# EAGLE design Ambulance Signal (EAGLE 7.6.0)
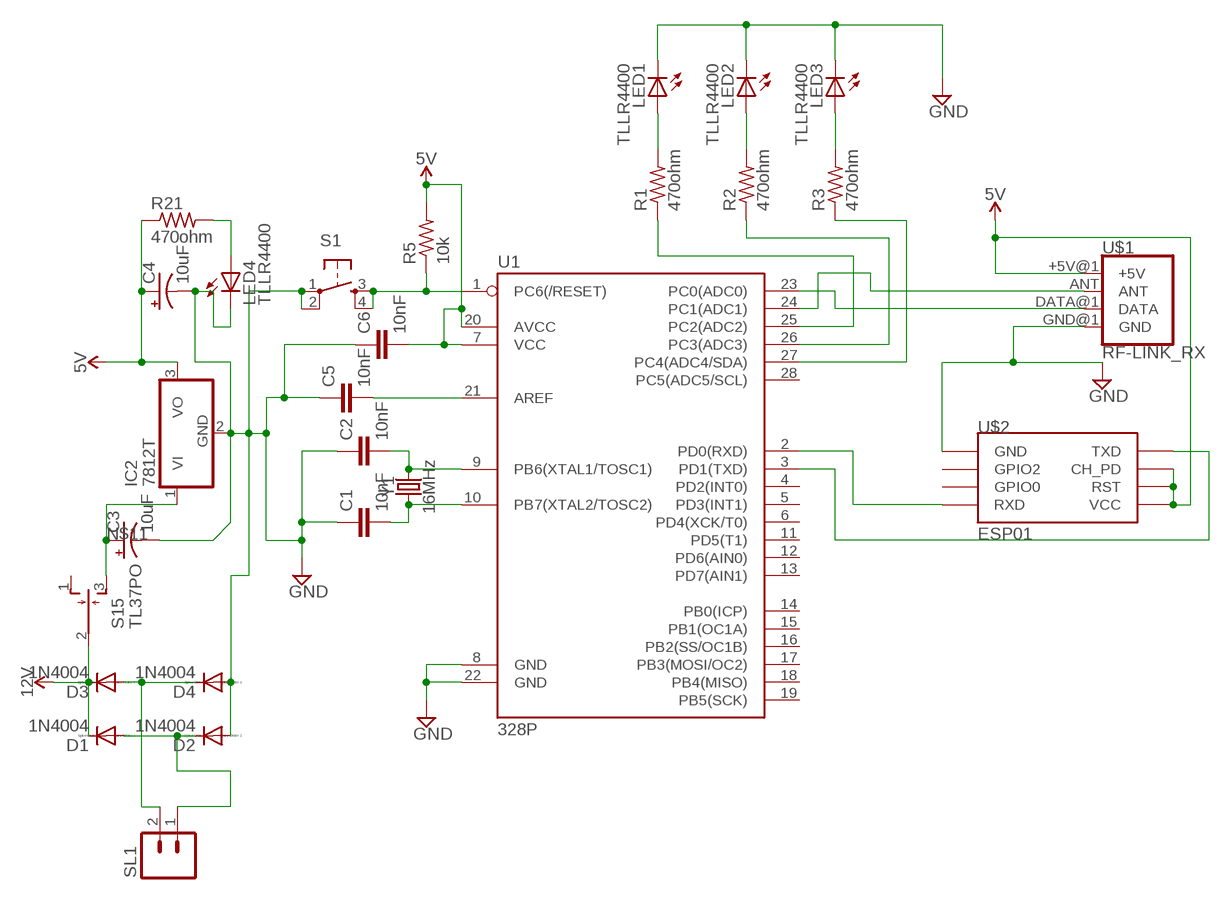
[diagram p0: schematic, sheet 1]

## Parts
C1  10nF  10NF-PTH-10MM-10000V-1-%  [CAP-PTH-10MM]
C2  10nF  10NF-PTH-10MM-10000V-1-%  [CAP-PTH-10MM]
C3  10uF  10UF-POLAR-RADIAL-2.5MM-KIT-25V-20%  [CPOL-RADIAL-2.5MM-5MM-KIT]
C4  10uF  10UF-POLAR-RADIAL-2.5MM-KIT-25V-20%  [CPOL-RADIAL-2.5MM-5MM-KIT]
C5  10nF  10NF-PTH-10MM-10000V-1-%  [CAP-PTH-10MM]
C6  10nF  10NF-PTH-10MM-10000V-1-%  [CAP-PTH-10MM]
D1  1N4004  [DO41-10]
D2  1N4004  [DO41-10]
D3  1N4004  [DO41-10]
D4  1N4004  [DO41-10]
IC2  7812T  [TO220H]
LED1  TLLR4400  [LED3MM]
LED2  TLLR4400  [LED3MM]
LED3  TLLR4400  [LED3MM]
LED4  TLLR4400  [LED3MM]
R1  470ohm  R-US_0207/12  [0207/12]
R2  470ohm  R-US_0207/12  [0207/12]
R3  470ohm  R-US_0207/12  [0207/12]
R5  10k  R-US_0207/12  [0207/12]
R21  470ohm  R-US_0207/12  [0207/12]
S1  TAC_SWITCHPTH  [TACTILE-PTH]
S15  TL37PO  [TL3XPO]
SL1  MA02  [02PA]
U1  328P  ATMEGA328P_PDIP  [DIP28]
U$1  RF-LINK_RX  [RF-LINK_RX]
U$2  ESP01  [ESP01]
Y1  16MHz  CRYSTAL-16MHZPTH-HC49US  [HC49US]

## Nets
5V: C4.1(+) C6.2 IC2.3(VO) R5.2 R21.1 U1.7(VCC) U1.20(AVCC) U$1.+5V@1(+5V) U$2.CH_PD U$2.RST U$2.VCC
12V: D1.C D3.C S15.2(P)
GND: C1.1 C2.1 C3.2(-) C4.2(-) C5.1 C6.1 D2.A D4.A IC2.2(GND) LED1.K(C) LED2.K(C) LED3.K(C) LED4.K(C) S1.1 S1.2 U1.8(GND) U1.22(GND) U$1.GND@1(GND) U$2.GND
N$1: U1.24(PC1(ADC1)) U$1.ANT
N$2: U1.23(PC0(ADC0)) U$1.DATA@1(DATA)
N$3: C2.2 U1.9(PB6(XTAL1/TOSC1)) Y1.2
N$4: C1.2 U1.10(PB7(XTAL2/TOSC2)) Y1.1
N$5: LED4.A R21.2
N$6: C5.2 U1.21(AREF)
N$9: R5.1 S1.3 S1.4 U1.1(PC6(/RESET))
N$10: D3.A D4.C SL1.2
N$11: C3.1(+) IC2.1(VI) S15.3(S)
N$12: U1.2(PD0(RXD)) U$2.RX(RXD)
N$13: U1.3(PD1(TXD)) U$2.TX(TXD)
N$14: R1.1 U1.25(PC2(ADC2))
N$15: R2.1 U1.26(PC3(ADC3))
N$16: R3.1 U1.27(PC4(ADC4/SDA))
N$17: LED1.A R1.2
N$18: LED2.A R2.2
N$19: LED3.A R3.2
N$50: D1.A D2.C SL1.1
Unconnected: S15.1(O) U1.4(PD2(INT0)) U1.5(PD3(INT1)) U1.6(PD4(XCK/T0)) U1.11(PD5(T1)) U1.12(PD6(AIN0)) U1.13(PD7(AIN1)) U1.14(PB0(ICP)) U1.15(PB1(OC1A)) U1.16(PB2(SS/OC1B)) U1.17(PB3(MOSI/OC2)) U1.18(PB4(MISO)) U1.19(PB5(SCK)) U1.28(PC5(ADC5/SCL)) U$2.GPIO0 U$2.GPIO2

## Library data of the parts
C1 C2 C5 C6 = SparkFun-Capacitors:10NF: 0.01uF/10nF/10,000pF ceramic capacitors A capacitor is a passive two-terminal electrical component used to store electrical energy temporarily in an electric field. CAP-09321; PROD_ID: CAP-09321
C3 C4 = SparkFun-Capacitors:10UF-POLAR: 10.0µF polarized capacitors A capacitor is a passive two-terminal electrical component used to store electrical energy temporarily in an electric field.; PROD_ID: CAP-08440
D1-D4 = diode:1N4004: DIODE general purpose rectifier, 1 A
IC2 = linear:78*: Positive VOLTAGE REGULATOR Source: http://cache.national.com/ds/LM/LM78L05.pdf http://www.fairchildsemi.com/ds/LM/LM7805.pdf
LED1-LED4 = led:TLLR4400: Low Current (2mA) LED 3 mm Tinted Diffused Package color RED Source: Data sheet <http://www.farnell.com/datasheets/391100.pdf>; MF: VISHAY SEMICONDUCTOR; OC_FARNELL: 1612437
R1-R3 R5 R21 = rcl:R-US_: RESISTOR, American symbol
S1 = SparkFun-Retired:TAC_SWITCH: Momentary Switch Button commonly used for reset or general input. Spark Fun Electronics SKU : COM-00097 SMT- SWCH-08247
S15 = switch:TL37PO: TINY SWITCH MOM OFF MOM Source: http://www2.produktinfo.conrad.com/datenblaetter/700000-724999/705152-da-01-de-Subminiaturschalter_TL_36YO.pdf
SL1 = con-amp-quick:MA02: AMP QUICK CONNECTOR; OC_FARNELL: unknown; OC_NEWARK: unknown
U1 = SparkFun-IC-Microcontroller:ATMEGA328P_PDIP: Atmel 328P Through hole ATMEGA328P uC used in the Arduino 32kb flash, 1k EEPROM, 2k SRAM Datasheet <http://www.sparkfun.com/datasheets/Components/SMD/ATMega328.pdf> SparkFun Products Storefront component: AVR 28 Pin 20MHz 32K 6A/D - ATMega328P <https://www.sparkfun.com/products/9061> (COM-09061) SparkFun Simon Says - Through-Hole Soldering Kit <https://www.sparkfun.com/products/10547> (KIT-10547) SparkFun Learn to Solder - Simon Says <https://www.sparkfun.com/products/13708> (KIT-13708) SparkFun BigTime Watch Kit <https://www.sparkfun.com/products/11734> (KIT-11734) SparkFun ClockIt <https://www.sparkfun.com/products/10930> (KIT-10930) SparkFun Serial Enabled LCD Kit <https://www.sparkfun.com/products/10097> (LCD-10097) SparkFun Simon Tilts - Through Hole Soldering Kit <https://www.sparkfun.com/products/12634> (KIT-12634) SparkFun Frequency Counter Kit <https://www.sparkfun.com/products/10140> (KIT-10140) FabFM Radio Kit <https://www.sparkfun.com/products/11043> (KIT-11043) SparkFun Binary Blaster Kit <https://www.sparkfun.com/products/12037> (KIT-12037) SparkFun Metro-Gnome <https://www.sparkfun.com/products/9236> (KIT-09236) ATmega328 with Arduino Optiboot (Uno) <https://www.sparkfun.com/products/10524> (DEV-10524); PROD_ID: IC-09136
U$1 = SparkFun-RF:RF-LINK_RX: RF Link Receiver (434 MHz, 315 MHz) These wireless receivers work with equivalent transmitters. They can easily fit into a breadboard and work well with microcontrollers to create a very simple wireless data link. Since these are only receivers, they will only work communicating data one-way, you would need two pairs (of different frequencies) to act as a transmitter/receiver pair.. SparkFun Products RF Link Receiver - 4800bps (434 MHz) <https://www.sparkfun.com/products/10532>(WRL-10532); SF_ID: WRL-10533
U$2 = esp8266modules:ESP01: ESP8266 Wifi module 01
Y1 = SparkFun-Clocks:CRYSTAL-16MHZ: 16MHz Crystal Digikey Example <http://www.digikey.com/product-search/en?keywords=535-9122-1-ND> Frequency: 16MHz Frequency Stability: ±50ppm Frequency Tolerance: ±20ppm Load Capacitance: 18pF SparkFun Products: Pro Micro -5V/16MHz <https://www.sparkfun.com/products/12640> SparkFun Serial Enabled LCD Kit <https://www.sparkfun.com/products/10097>; PROD_ID: XTAL-08181; SF_ID: COM-00536

## Board
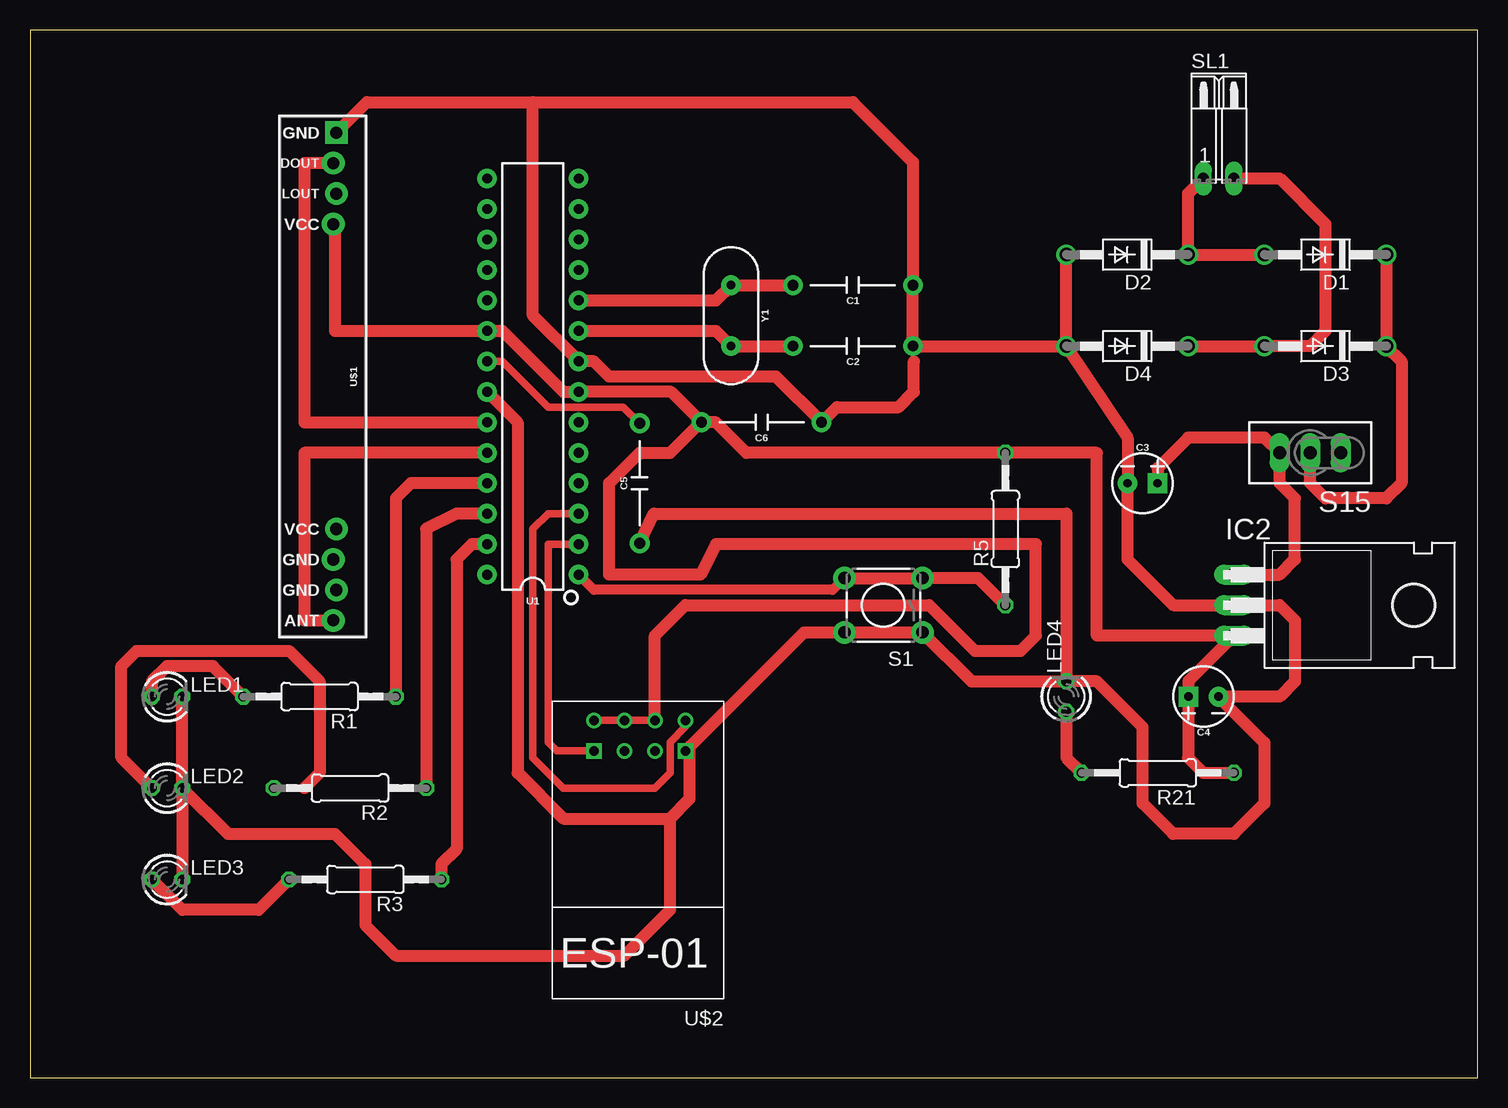
[diagram p1: board, top side]
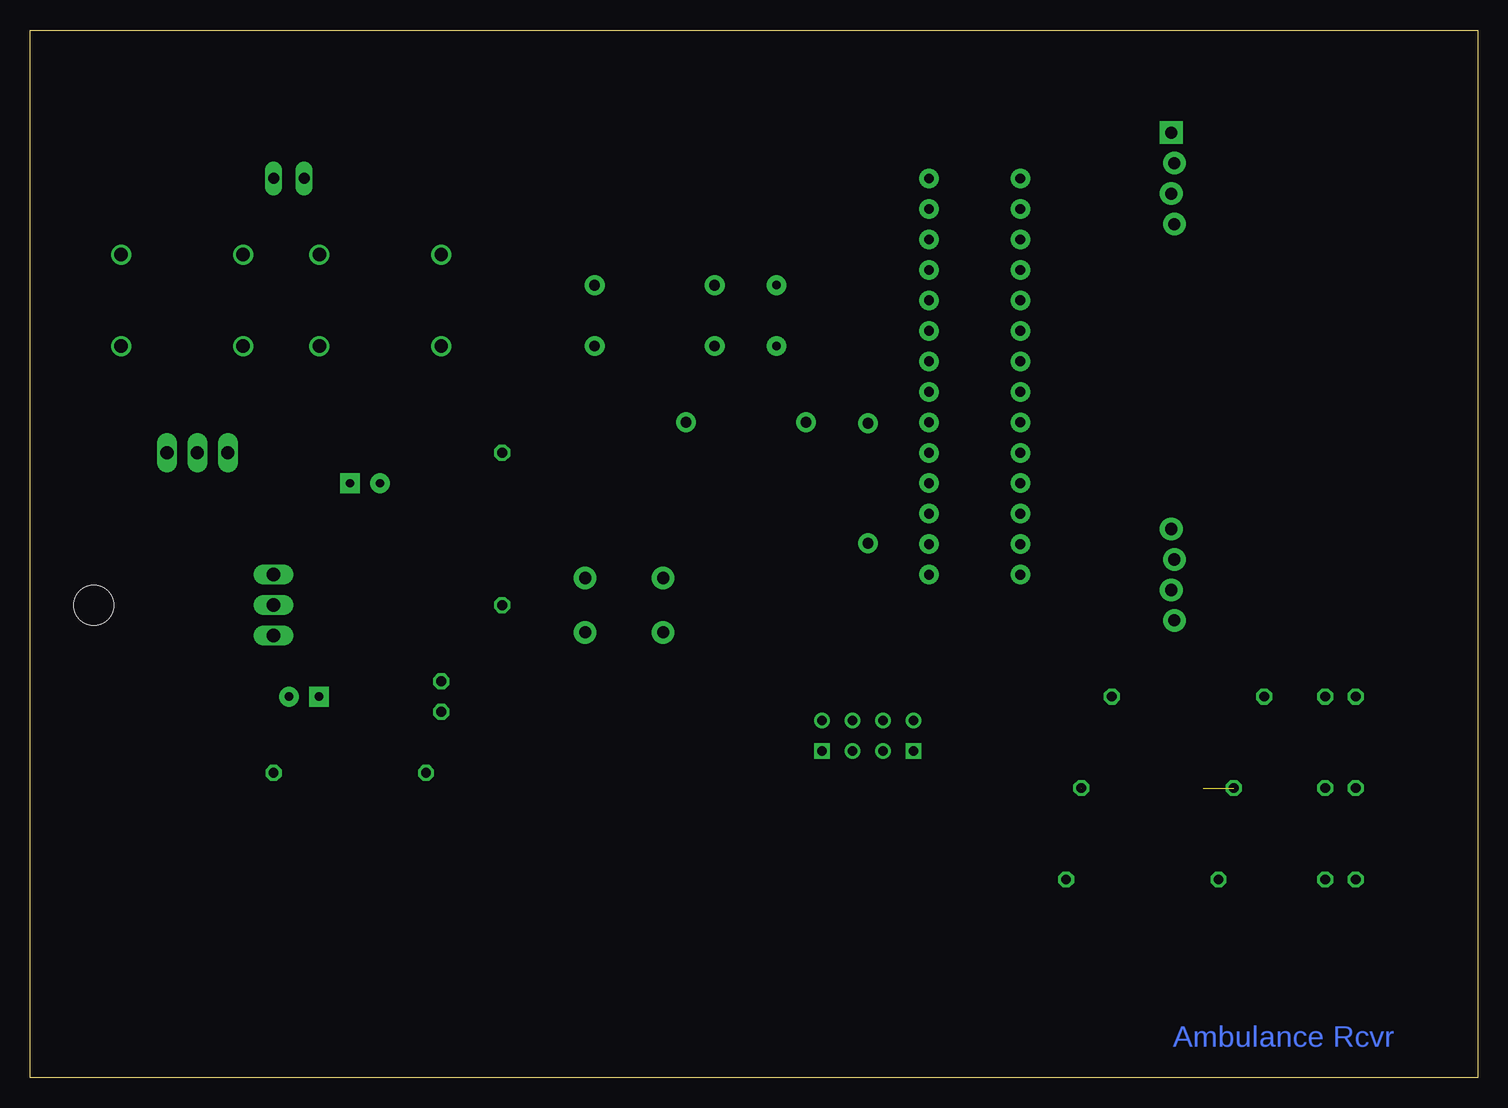
[diagram p2: board, bottom side, seen from below]

Size 120.63 x 87.3 mm. Coordinates in mm from the lower left corner, seen from the top.
Outline: 0,0 120.63,0 120.63,87.3 0,87.3 0,0
Copper layers (1*16): Top 0.035mm / dielectric 1.5mm / Bottom 0.035mm
Design rules "default": minimum track width 10mil, minimum drill 24mil, track to track 8mil, track to pad 8mil, pad to pad 8mil, via to via 8mil, smd to smd 8mil, copper to edge 40mil, drill to drill 8mil, minimum pad ring 10mil, minimum via ring 8mil, stop-mask expansion 4mil, vias tented up to drill 0mil, thermal gap 10mil

### Footprints (pad centres in the part's own frame; a part is rotated, then mirrored left to right if it is on the bottom)
CAP-PTH-10MM = drill 0.9 pad 1.651: 1 -5,0; 2 5,0
CPOL-RADIAL-2.5MM-5MM-KIT = drill 0.7 pad 1.651 square: 1 1.25,0 | drill 0.7 pad 1.651: 2 -1.25,0
DO41-10 = drill 1.118: A 5.08,0; C -5.08,0
TO220H = drill 1.118 long: 1 -2.54,-10.16; 2 0,-10.16; 3 2.54,-10.16 | hole 3.302: 0,4.826
LED3MM = drill 0.813 octagon: A -1.27,0; K 1.27,0
0207/12 = drill 0.813 octagon: 1 -6.35,0; 2 6.35,0
TACTILE-PTH = drill 1.016 pad 1.88: 1 -3.251,2.261; 2 3.251,2.261; 3 -3.251,-2.261; 4 3.251,-2.261
TL3XPO = drill 1.1 pad 1.422 long: 1 -2.54,0; 2 0,0; 3 2.54,0
02PA = drill 0.914 long: 1 -1.27,0; 2 1.27,0
DIP28 = drill 0.813 pad 1.626: 1 -16.51,-3.81; 2 -13.97,-3.81; 3 -11.43,-3.81; 4 -8.89,-3.81; 5 -6.35,-3.81; 6 -3.81,-3.81; 7 -1.27,-3.81; 8 1.27,-3.81; 9 3.81,-3.81; 10 6.35,-3.81; 11 8.89,-3.81; 12 11.43,-3.81; 13 13.97,-3.81; 14 16.51,-3.81; 15 16.51,3.81; 16 13.97,3.81; 17 11.43,3.81; 18 8.89,3.81; 19 6.35,3.81; 20 3.81,3.81; 21 1.27,3.81; 22 -1.27,3.81; 23 -3.81,3.81; 24 -6.35,3.81; 25 -8.89,3.81; 26 -11.43,3.81; 27 -13.97,3.81; 28 -16.51,3.81
RF-LINK_RX = drill 1.016 pad 1.88: +5V@1 -12.7,-0.127; +5V@2 12.7,0.127; ANT 20.32,-0.127; DATA@1 -17.78,-0.127; DATA@2 -15.24,0.127; GND@2 15.24,-0.127; GND@3 17.78,0.127 | drill 1.016 pad 1.88 square: GND@1 -20.32,0.127
ESP01 = drill 0.8: CH_PD -1.285,-8.178; GPIO0 1.255,-5.638; GPIO2 -1.285,-5.638; RST 1.255,-8.178; TX -3.825,-8.178; VCC 3.795,-8.178 | drill 0.8 square: GND -3.825,-5.638; RX 3.795,-5.638
HC49US = drill 0.7 pad 1.651: 1 -2.54,0; 2 2.54,0

### Placement (x,y rotation side)
C1  68.58,66.04 180 top
C2  68.58,60.96 180 top
C3  92.71,49.53 0 top
C4  97.79,31.75 180 top
C5  50.8,49.53 90 top
C6  60.96,54.61 180 top
D1  107.95,68.58 180 top
D2  91.44,68.58 180 top
D3  107.95,60.96 180 top
D4  91.44,60.96 180 top
IC2  110.49,39.37 270 top
LED1  11.43,31.75 0 top
LED2  11.43,24.13 0 top
LED3  11.43,16.51 0 top
LED4  86.36,31.75 90 top
R1  24.13,31.75 180 top
R2  26.67,24.13 180 top
R3  27.94,16.51 180 top
R5  81.28,45.72 90 top
R21  93.98,25.4 180 top
S1  71.12,39.37 180 top
S15  106.68,52.07 180 top
SL1  99.06,74.93 0 top
U1  41.91,58.42 90 top
U$1  25.4,58.42 270 top
U$2  50.8,21.59 180 top
Y1  58.42,63.5 270 top

### Tracks (layer width: path | path; a pad name or v marks a point on that pad's centre or on a via)
5V
  Top 0.61: U$2.VCC U$2.RST U$2.CH_PD
  Top 1.016: R21.1 97.79,25.4 96.52,26.67 96.52,31.73 C4.1 96.54,33.04 IC2.3 88.9,36.83 88.9,52.07 R5.2 59.69,52.07 57.15,54.61 C6.2 | C6.2 53.42,57.15 U1.7 44.45,57.15 39.37,62.23 U1.20 25.4,62.23 25.4,71.25 U$1.+5V@1 | U$2.CH_PD 52.07,29.78 52.07,36.83 54.61,39.37 74.93,39.37 78.74,35.56 82.55,35.56 83.82,36.83 83.82,44.45 57.15,44.45 55.88,41.91 48.26,41.91 48.26,49.53 50.8,52.07 53.34,52.07 55.88,54.61 C6.2
12V
  Top 1.016: D1.C D3.C 114.3,59.69 114.3,49.53 113.03,48.26 107.95,48.26 106.68,49.53 S15.2
GND
  Top 1.016: D4.A D2.A | D4.A 91.46,53.32 C3.2 91.44,49.51 91.44,43.18 95.25,39.37 IC2.2 104.14,39.37 105.41,38.1 105.41,33.02 104.14,31.75 C4.2 102.87,27.92 102.87,22.86 100.33,20.32 95.25,20.32 92.71,22.86 92.71,29.21 88.9,33.02 LED4.K | LED4.K 78.46,33.02 S1.1 S1.2 64.51,37.11 54.97,27.58 | D4.A C2.1 C1.1 73.58,76.28 68.58,81.28 41.91,81.28 | 73.66,59.69 73.66,57.15 72.39,55.88 67.23,55.88 C6.1 62.15,58.42 48.26,58.42 46.99,59.69 U1.8 41.91,63.5 41.91,81.28 | U$1.GND@1 28.07,81.28 41.91,81.28 | LED2.K LED1.K | LED2.K LED3.K | C5.1 51.99,46.99 86.36,46.99 LED4.K | U$2.GND 54.97,27.58 | U1.22 40.64,54.61 40.64,25.4 44.45,21.59 53.34,21.59 | 53.34,21.59 54.97,23.22 54.97,27.58 | LED2.K 16.51,20.32 25.4,20.32 27.94,17.78 27.94,12.7 30.48,10.16 49.53,10.16 53.34,13.97 53.34,21.59
N$1
  Top 1.016: U1.24 22.86,52.07 22.86,38.1 U$1.ANT
N$2
  Top 1.016: U$1.DATA@1 22.86,76.2 22.86,54.61 U1.23
N$3
  Top 1.016: U1.9 57.15,62.23 Y1.2 C2.2
N$4
  Top 1.016: U1.10 57.15,64.77 Y1.1 C1.2
N$5
  Top 1.016: LED4.A 86.36,26.67 R21.2
N$6
  Top 0.61: C5.2 49.45,55.88 43.18,55.88 39.37,59.69 U1.21
N$9
  Top 0.813: S1.4 66.88,40.64 46.99,40.64 U1.1
  Top 1.016: R5.1 79.02,41.63 S1.3 S1.4
N$10
  Top 1.016: D4.C D3.A 106.68,60.96 107.95,62.23 107.95,71.12 104.14,74.93 SL1.2
N$11
  Top 1.016: C3.1 93.96,50.78 96.52,53.34 102.87,53.34 S15.3 104.14,49.53 105.41,48.26 105.41,43.18 104.14,41.91 IC2.1
N$12
  Top 0.61: U1.2 43.18,44.45 43.18,27.94 43.89,27.23 U$2.RX
N$13
  Top 0.61: U1.3 43.18,46.99 41.91,45.72 41.91,26.67 44.45,24.13 52.07,24.13 53.34,25.4 53.34,27.94 54.62,29.23 U$2.TX
N$14
  Top 1.016: U1.25 31.75,49.53 30.48,48.26 R1.1
N$15  (1 unrouted)
  Top 1.016: U1.26 35.56,46.99 33.02,45.72 R2.1
N$16
  Top 1.016: U1.27 36.83,44.45 35.56,43.18 35.56,19.05 34.29,17.78 R3.1
N$17
  Top 1.016: R1.2 15.24,34.29 11.43,34.29 10.16,33.02 LED1.A
N$18  (1 unrouted)
  Top 1.016: LED2.A 7.62,26.67 7.62,34.29 8.89,35.56 21.59,35.56 24.13,33.02 24.13,25.4 22.86,24.13
N$19
  Top 1.016: R3.2 19.05,13.97 12.7,13.97 LED3.A
N$50
  Top 1.016: SL1.1 96.52,73.66 D2.C D1.A

### Text on the board
Bottom: Ambulance Rcvr